# Altium schematic sheet POWER_MOTORS.SchDoc
size Tabloid; SheetNumber: 24; SheetTotal: 25; Sheet_Name: POWER; Size: 11x17
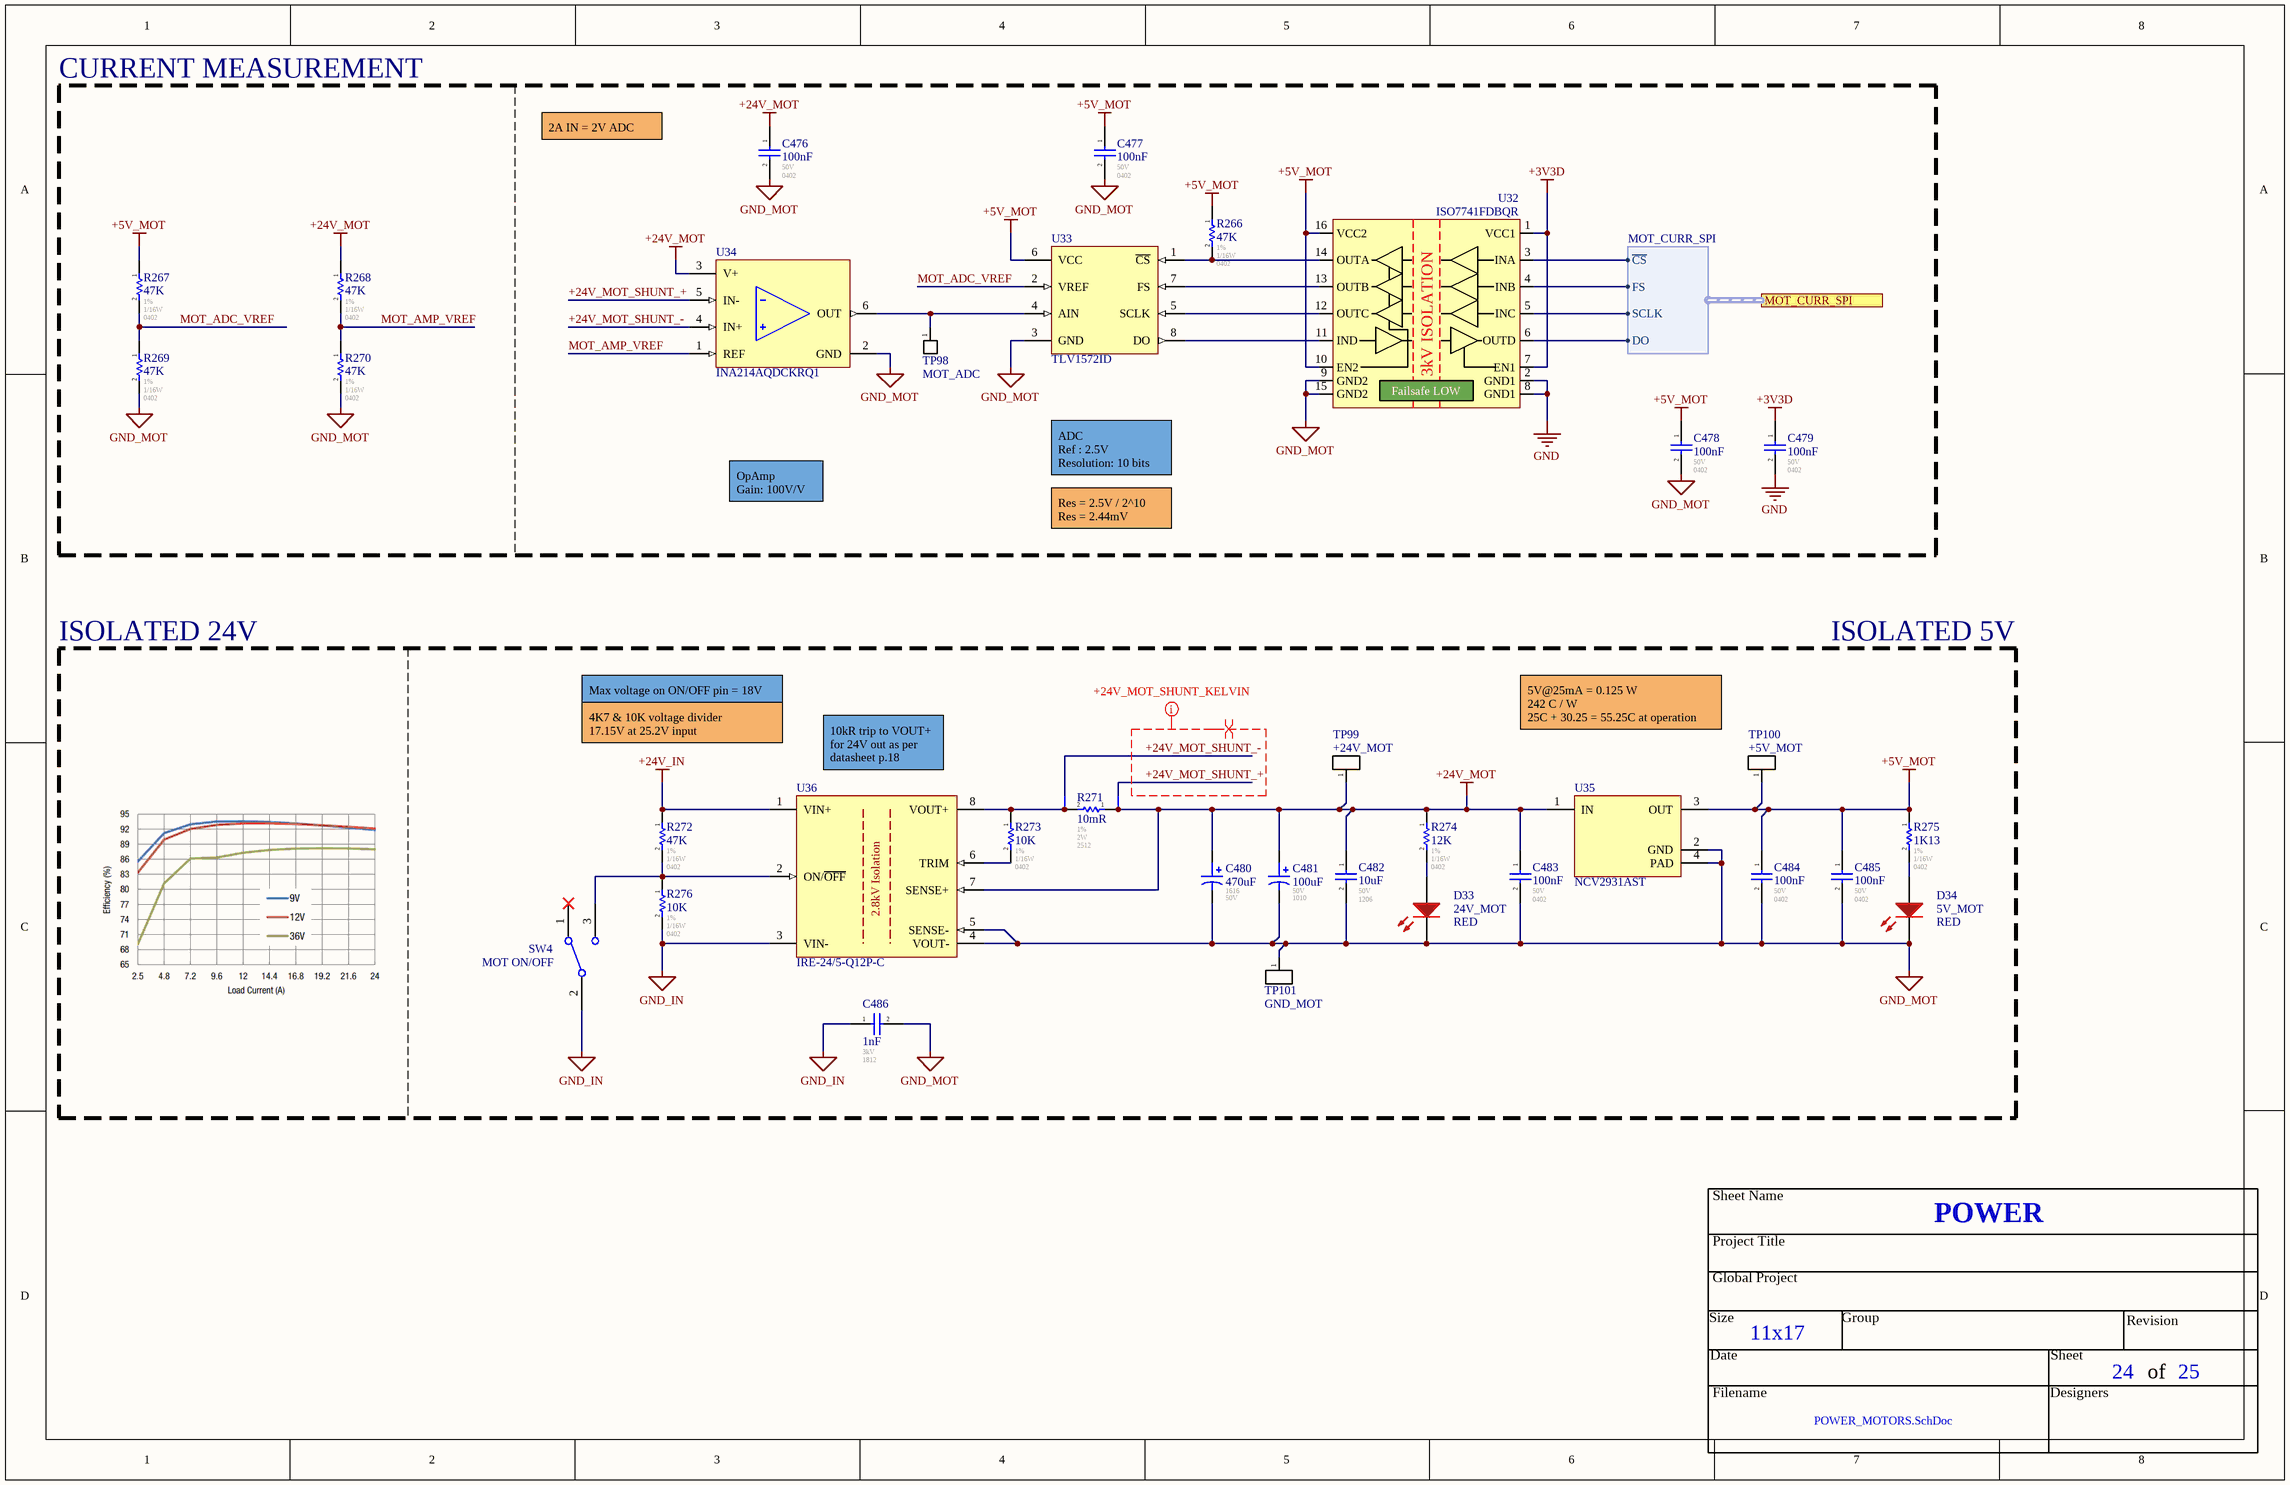
[diagram p0: POWER_MOTORS.SchDoc]

## Parts
C476  100nF  Voltage - Rated: 50V  Footprint: 0402  [CAP_0402]
C477  100nF  Voltage - Rated: 50V  Footprint: 0402  [CAP_0402]
C478  100nF  Voltage - Rated: 50V  Footprint: 0402  [CAP_0402]
C479  100nF  Voltage - Rated: 50V  Footprint: 0402  [CAP_0402]
C480  value 470uF  Voltage: 50V  Package: 1616  [CAP_ALU_1616_vishay]  (hidden comment: MAL214699108E3)
C481  value 100uF  Voltage: 50V  Package: 1010  [CAP_ALU_1010_vishay]  (hidden comment: MAL215099101E3)
C482  10uF  Voltage - Rated: 50V  Footprint: 1206  [CAP_1206]
C483  100nF  Voltage - Rated: 50V  Footprint: 0402  [CAP_0402]
C484  100nF  Voltage - Rated: 50V  Footprint: 0402  [CAP_0402]
C485  100nF  Voltage - Rated: 50V  Footprint: 0402  [CAP_0402]
C486  1nF  Voltage - Rated: 3kV  Footprint: 1812  [CAP_1812]
D33  24V_MOT  value RED  [LED_0603]
D34  5V_MOT  value RED  [LED_0603]
NT52  Net Tie  [NETTIE_5]  (value not drawn)  (net tie, no BOM)
NT53  Net Tie  [NETTIE_5]  (value not drawn)  (net tie, no BOM)
R266  47K  Tolerance: 1%  Power: 1/16W  Package / Case: 0402  [RES_0402]
R267  47K  Tolerance: 1%  Power: 1/16W  Package / Case: 0402  [RES_0402]
R268  47K  Tolerance: 1%  Power: 1/16W  Package / Case: 0402  [RES_0402]
R269  47K  Tolerance: 1%  Power: 1/16W  Package / Case: 0402  [RES_0402]
R270  47K  Tolerance: 1%  Power: 1/16W  Package / Case: 0402  [RES_0402]
R271  10mR  Tolerance: 1%  Power: 2W  Package / Case: 2512  [RES_2512]
R272  47K  Tolerance: 1%  Power: 1/16W  Package / Case: 0402  [RES_0402]
R273  10K  Tolerance: 1%  Power: 1/16W  Package / Case: 0402  [RES_0402]
R274  12K  Tolerance: 1%  Power: 1/16W  Package / Case: 0402  [RES_0402]
R275  1K13  Tolerance: 1%  Power: 1/16W  Package / Case: 0402  [RES_0402]
R276  10K  Tolerance: 1%  Power: 1/16W  Package / Case: 0402  [RES_0402]
SW4  MOT ON/OFF  [1101M2S3CQE2]
TP98  MOT_ADC  [TP_PAD]  (no BOM)
TP99  +24V_MOT  [TP_HOLE]  (no BOM)
TP100  +5V_MOT  [TP_HOLE]  (no BOM)
TP101  GND_MOT  [TP_HOLE]  (no BOM)
U32  ISO7741FDBQR  [ISO_ISO7741FDBQR]
U33  TLV1572ID  [SOIC-8_3.8mm]
U34  INA214AQDCKRQ1  [SC-70-6 (SOT-363)]
U35  NCV2931AST  [SOT223-4]
U36  IRE-24/5-Q12P-C  [IRE-Q12]

## Blocks framed on the sheet
CURRENT MEASUREMENT: C476-C479 R266-R270 TP98 U32-U34

## Ports
MOT_CURR_SPI (harness MOT_CURR_SPI)

## Harnesses
MOT_CURR_SPI: ~{CS}, FS, SCLK, DO

## Nets
+3V3D: C479.1 U32.1(VCC1) U32.7(EN1)
+5V_MOT: C477.1 C478.1 C484.1 C485.1 R266.1 R267.1 R275.1 TP100.1(A) U32.10(EN2) U32.16(VCC2) U33.6(VCC) U35.3(OUT)
+24V_IN: R272.1 U36.1(VIN+)
+24V_MOT: C476.1 C480.1 C481.1 C482.1 C483.1 NT53.1 R268.1 R271.1 R274.1 TP99.1(A) U34.3(V+) U35.1(IN) U36.7(SENSE+)
GND: C479.2 U32.2(GND1) U32.8(GND1)
GND_IN: C486.1 R276.2 SW4.2(P) U36.3(VIN-)
GND_MOT: C476.2 C477.2 C478.2 C480.2 C481.2 C482.2 C483.2 C484.2 C485.2 C486.2 D33.2(K) D34.2(K) R269.2 R270.2 TP101.1(A) U32.9(GND2) U32.15(GND2) U33.3(GND) U34.2(GND) U35.2(GND) U35.4(PAD) U36.4(VOUT-) U36.5(SENSE-)
+24V_MOT_SHUNT_+: NT53.2 U34.5(IN-)
+24V_MOT_SHUNT_-: NT52.2 U34.4(IN+)
MOT_ADC_VREF: R267.2 R269.1 U33.2(VREF)
MOT_AMP_VREF: R268.2 R270.1 U34.1(REF)
NetD33_1: D33.1(A) R274.2
NetD34_1: D34.1(A) R275.2
NetNT52_1: NT52.1 R271.2 R273.1 U36.8(VOUT+)
NetR266_2: R266.2 U32.14(OUTA) U33.1(~{CS})
NetR272_2: R272.2 R276.1 SW4.3(B) U36.2(ON/~{OFF})
NetR273_2: R273.2 U36.6(TRIM)
NetTP98_1: TP98.1(A) U33.4(AIN) U34.6(OUT)
NetU32_3: U32.3(INA) ; port MOT_CURR_SPI.~{CS}
NetU32_4: U32.4(INB) ; port MOT_CURR_SPI.FS
NetU32_5: U32.5(INC) ; port MOT_CURR_SPI.SCLK
NetU32_6: U32.6(OUTD) ; port MOT_CURR_SPI.DO
NetU32_11: U32.11(IND) U33.8(DO)
NetU32_12: U32.12(OUTC) U33.5(SCLK)
NetU32_13: U32.13(OUTB) U33.7(FS)

Not connected (* = marked no-connect by the designer): SW4 1(A)*

## Layout directives
net class +24V_MOT_SHUNT_KELVIN: +24V_MOT_SHUNT_+, +24V_MOT_SHUNT_-
differential pair: +24V_MOT_SHUNT_+, +24V_MOT_SHUNT_-

## Notes on the sheet
- 2A IN = 2V ADC
- OpAmp
  Gain: 100V/V
- ADC
  Ref : 2.5V
  Resolution: 10 bits
- Res = 2.5V / 2^10
  Res = 2.44mV
- ISOLATED 24V
- Max voltage on ON/OFF pin = 18V
- ISOLATED 5V
- 4K7 & 10K voltage divider
  17.15V at 25.2V input
- (near U36) 10kR trip to VOUT+ for 24V out as per datasheet p.18
- 5V@25mA = 0.125 W
  242 C / W
  25C + 30.25 = 55.25C at operation
- Sheet Name
- Project Title
- Global Project
- Revision
- Size
- Date
- Group
- Sheet
- of
- Filename
- Designers
- (in symbol IRE-24/5-Q12P-C) 2.8kV Isolation
- (in symbol ISO_ISO7741FDBQR) 3kV ISOLATION; Failsafe LOW

## Library data of the parts
C476-C479 C483-C485 = CAP_CER: GCM155R71H104KE02J / 0402 100nF 10% X7R Ceramic Capacitor; Mfr: Murata; Operating Temperature: -55C - 125C; Temperature Coefficient: X7R; ComponentLink1Description: Digikey; ComponentLink1URL: [Digikey Link]; Part#: GCM155R71H104KE02J; ComponentLink2Description: Datasheet; ComponentLink2URL: [Datasheet Link]; Tolerance: 10%; Ratings: AEC-Q200
C480 = CAP_ALU_MAL214699108E3: CAP - ALU 470uF 20% 50V - 1616; Current: 1.3A; Mfg: Vishay Dale; Mfg Part Number: MAL214699108E3; HelpURL: http://www.vishay.com/docs/28403/146cti.pdf; CreatedBy: Jonathan Bouchard; Temperature: -55°C to 125°C; Power: *; Supplier 1: Digikey; Supplier Part Number 1: 4442PHCT-ND; Precision: 20%
C481 = CAP_ALU_MAL215099101E3: CAP - ALU 100uF 20% 50V - 1010; Current: 490mA; Mfg: Vishay Dale; Mfg Part Number: MAL215099101E3; HelpURL: http://www.vishay.com/docs/28395/150crz.pdf; CreatedBy: Jonathan Bouchard; Temperature: -55°C to 125°C; Power: *; Supplier 1: Digikey; Supplier Part Number 1: 4399PHDKR-ND; Precision: 20%
C482 = CAP_CER: GRT31CR61H106KE01L / 1206 10uF 10% X5R Ceramic Capacitor; Mfr: Murata; Operating Temperature: -55C - 85C; Temperature Coefficient: X5R; ComponentLink1Description: Digikey; ComponentLink1URL: [Digikey Link]; ComponentLink2Description: Datasheet; ComponentLink2URL: [Datasheet Link]; Tolerance: 10%; Ratings: AEC-Q200; Supplier 1: Arrow Electronics; Supplier Part Number 1: GRT31CR61H106KE01L; Part#: GRT31CR61H106KE01L
C486 = CAP_CER: C1812C102KHRACAUTO / 0402 470pF 10% X7R Ceramic Capacitor; Mfr: KEMET; Operating Temperature: -55C - 125C; Temperature Coefficient: X7R; ComponentLink1Description: Digikey; ComponentLink1URL: https://www.digikey.com/en/products/detail/kemet/C1812C102KHRACAUTO/8109956; Part#: C1812C102KHRACAUTO; ComponentLink2Description: Datasheet; ComponentLink2URL: https://connect.kemet.com:7667/gateway/IntelliData-ComponentDocumentation/1.0/download/datasheet/C1812C102KHRACAUTO; Tolerance: 10%; Ratings: AEC-Q200; ComponentLink3Description: KEMET; ComponentLink3URL: https://www.kemet.com/en/us/capacitors/ceramic/product/C1812C102KHRACAUTO.html; ComponentLink4Description: Octopart; ComponentLink4URL: https://octopart.com/c1812c102khracauto-kemet-67309371?r=sp; Features: Low ESL, High Voltage; Supplier 1: Mouser; Supplier Part Number 1: 80-C1812C102KHRAUTO
D33 D34 = LED_SML-311UTT86: LED - 620nM RED 2mA - 0603; Voltage: 1.8V; Mfg: ROHM Semiconductor; Power: 44mW; Current: 2mA; HelpURL: http://media.digikey.com/pdf/Data%20Sheets/Rohm%20PDFs/SML-311%20Series.pdf; CreatedBy: Jonathan Bouchard; Temperature: -30°C to 85°C; Package: 0603; Precision: *; Mfg Part Number: SML-311UTT86; Supplier 1: Digikey; Supplier Part Number 1: 511-1304-1-ND
NT52 NT53 = NET_TIE_SMALL
R266-R270 R272-R276 = RESISTOR: Automotive: AEC-Q200; Operating Temperature: *; # Digikey: *; ComponentLink1Description: Digikey; ComponentLink1URL: *; # Manufacturer: *
R271 = RESISTOR: CSRN2512FK10L0; Automotive: AEC-Q200; Operating Temperature: -55C - 155C; ComponentLink1Description: Digikey; ComponentLink1URL: https://www.digikey.ca/fr/products/detail/stackpole-electronics-inc/CSRN2512FK10L0/1646104; Part #: CSRN2512FK10L0
SW4 = SPDT_SWITCH: Slide Switch SPDT Through Hole; Mfr: C&K; Switch Function: On-Off-On; Current Rating: 6A; Voltage Rating - AC: 120V; Voltage Rating - DC: 28V; Cycles: 40000; Operating Temperature: -30C - 65C; ComponentLink1Description: Digikey; ComponentLink1URL: https://www.digikey.ca/en/products/detail/c-k/1103M2S3CQE2/483721; ComponentLink2Description: Datasheet; ComponentLink2URL: https://www.ckswitches.com/media/1429/1000.pdf; ComponentLink3Description: Octopart; ComponentLink3URL: https://octopart.com/1103m2s3cqe2-c%26k+components-2492778?r=sp; Supplier 1: Arrow Electronics; Supplier Part Number 1: 1103M2S3CQE2
TP98 = TESTPOINT_PAD: Test Point
TP99-TP101 = TESTPOINT: Test Point; ClassName: Testpoint
U32 = ISO_ISO7741FDBQR: ISO - Quad-Channel Digital Isolator 3/1 (Default Low)- 16-SSOP; Manufacturer #1: Texas Instruments; Voltage Rating: 2.25-5.5V; GRAMS Lib Spec: 2.8c; Magnetic Material: Unknown; Polarized: Yes; Value: 3/1; Tolerance: *; Current Rating: *; Power Max: *; HelpURL: http://www.ti.com/lit/ds/symlink/iso7741.pdf; CreatedBy/Date: Louis-Daniel Gaulin / 11-03-2020; VerifiedBy: c.Paulin - 20/04/2020; Temperature: -55°C ~ 125°C; Package: 16-SSOP; Manufacturer #2: *; Assembly Type: SMD; Part Number #2: *; Part Number #1: ISO7741FDBQR; Supplier 1: Digi-Key; Supplier Part Number 1: 296-48140-1-ND; Cryo: UNKNOWN
U33 = TLV1572ID: Mfr: Texas Instruments; Number of Bits: 10; Number of Inputs: 1; Architecture: SAR; Voltage - Supply (Analog): 2.7V - 5.5V; ComponentLink1Description: Digikey; ComponentLink1URL: https://www.digikey.ca/en/products/detail/texas-instruments/TLV1572ID/277528; ComponentLink2Description: Datasheet; ComponentLink2URL: https://www.ti.com/lit/ds/symlink/tlv1572.pdf?HQS=dis-dk-null-digikeymode-dsf-pf-null-wwe&ts=1706610861795&ref_url=https%253A%252F%252Fwww.ti.com%252Fgeneral%252Fdocs%252Fsuppproductinfo.tsp%253FdistId%253D10%2526gotoUrl%253Dhttps%253A%252F%252Fwww.ti.com%252Flit%252Fgpn%252Ftlv1572; ComponentLink3Description: Texas Instruments; ComponentLink3URL: https://www.ti.com/product/TLV1572; Voltage - Supply (Digital): 2.7V - 5.5V; Operating Temperature: -30C - 85C
U34 = INA214AQDCKRQ1: Current Sense Amplifier 1 Circuit Single-Ended SC-70-6; Mfr: Texas Instruments; Voltage - Supply (Min): 2.7V; Voltage - Supply (Max): 26V; Gain Bandwidth Product: 30kHz; Current - Input Bias: 28µA; Voltage - Input Offset: 1µV; Gain: 100V/V; ComponentLink1Description: Digikey; ComponentLink1URL: https://www.digikey.com/en/products/detail/texas-instruments/INA214AQDCKRQ1/2361055; ComponentLink2Description: Datasheet; ComponentLink2URL: https://www.ti.com/lit/ds/symlink/ina213-q1.pdf?HQS=dis-dk-null-digikeymode-dsf-pf-null-wwe&ts=1706525130563&ref_url=https%253A%252F%252Fwww.ti.com%252Fgeneral%252Fdocs%252Fsuppproductinfo.tsp%253FdistId%253D10%2526gotoUrl%253Dhttps%253A%252F%252Fwww.ti.com%252Flit%252Fgpn%252Fina213-q1; ComponentLink3Description: Octopart; ComponentLink3URL: https://octopart.com/ina214aqdckrq1-texas+instruments-18804705?r=sp; ComponentLink4Description: Texas Instruments; ComponentLink4URL: https://www.ti.com/product/INA214-Q1/part-details/INA214AQDCKRQ1; Operating Temperature: -40C - 125C; Ratings: AEC-Q100; Voltage - Analog Input (Max): 26V; Supplier 1: Mouser
U35 = NCV2931AST-5T3G: 5.0 V LDO; Voltage - Input (Max): 26V; Voltage - Output: 5V; Current - Output (Max): 100mA; Current - Quiescent: 1mA; Qualification: AEC-Q100; Operating Temperature: -40C - 125C; ComponentLink1Description: Digikey; ComponentLink1URL: https://www.digikey.ca/en/products/detail/onsemi/NCV2931AST-5T3G/1483949; ComponentLink2Description: Datasheet; ComponentLink2URL: https://www.onsemi.com/pdf/datasheet/lm2931-d.pdf
U36 = IRE-24/5-Q12P-C: Isolated DC/DC Converters - Through Hole 9V-36VIN 24VOUT 120W; Mfr: Murata; Voltage - Output: 24V; Current - Output: 5A; Voltage - Input (Min): 9V; Voltage - Input (Max): 36V; Isolation Voltage: 2.828kV; Switching Frequency: 240kHz; Output Power: 120W; Operating Temperature: -40C - 85C; ComponentLink1Description: Mouser; ComponentLink1URL: https://www.mouser.ca/ProductDetail/Murata-Power-Solutions/IRE-24-5-Q12P-C?qs=xZ%2FP%252Ba9zWqZkiEXUCSXVgg%3D%3D; ComponentLink2Description: Murata; ComponentLink2URL: https://www.murata.com/en-us/products/productdetail?partno=IRE-24%2F5-Q12P-C; ComponentLink3Description: Datasheet; ComponentLink3URL: https://www.murata.com/products/productdata/8807029112862/ire-q12.pdf?1655388012000; ComponentLink4Description: Octopart; ComponentLink4URL: https://octopart.com/ire-24%2F5-q12p-c-murata+power+solutions-107236523?r=sp; Supplier 1: Mouser; Supplier Part Number 1: 580-IRE-24/5-Q12P-C